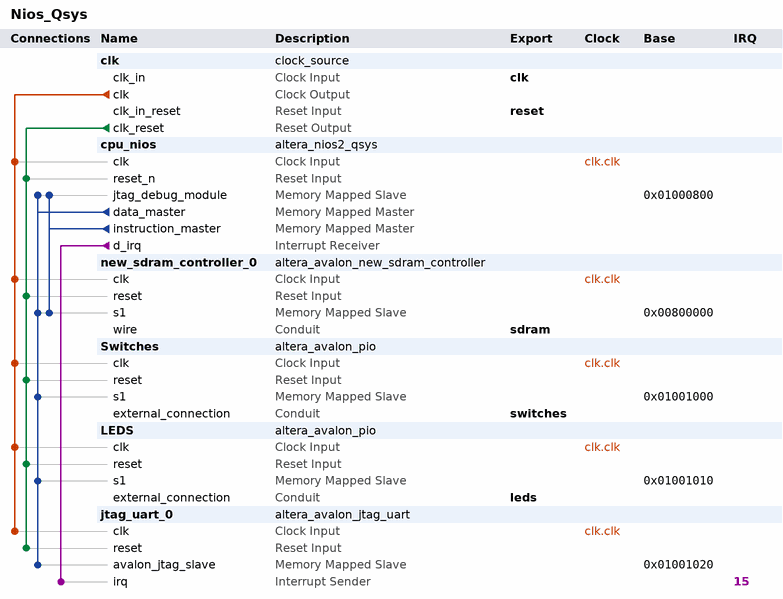
[diagram p0: system contents]
# Platform Designer (Qsys) system Nios_Qsys, Cyclone II EP2C35F672C6
# Parameters at their usual value, and those the tool derives, are not listed.
package require -exact qsys 13.0.1.99.2
create_system Nios_Qsys
set_project_property DEVICE_FAMILY {Cyclone II}
set_project_property DEVICE EP2C35F672C6

add_instance clk clock_source 13.0
set_instance_parameter_value clk clockFrequency 50000000

add_instance cpu_nios altera_nios2_qsys 13.0
set_instance_parameter_value cpu_nios resetSlave new_sdram_controller_0.s1
set_instance_parameter_value cpu_nios mmu_TLBMissExcSlave None
set_instance_parameter_value cpu_nios exceptionSlave new_sdram_controller_0.s1
set_instance_parameter_value cpu_nios breakSlave cpu_nios.jtag_debug_module
set_instance_parameter_value cpu_nios impl Tiny
set_instance_parameter_value cpu_nios icache_size 4096

add_instance new_sdram_controller_0 altera_avalon_new_sdram_controller 13.0.1.99.2
set_instance_parameter_value new_sdram_controller_0 TAC 5.5
set_instance_parameter_value new_sdram_controller_0 TRCD 20.0
set_instance_parameter_value new_sdram_controller_0 TRP 20.0
set_instance_parameter_value new_sdram_controller_0 casLatency 3
set_instance_parameter_value new_sdram_controller_0 columnWidth 8
set_instance_parameter_value new_sdram_controller_0 dataWidth 16
set_instance_parameter_value new_sdram_controller_0 generateSimulationModel false
set_instance_parameter_value new_sdram_controller_0 model single_Micron_MT48LC4M32B2_7_chip
set_instance_parameter_value new_sdram_controller_0 numberOfBanks 4
set_instance_parameter_value new_sdram_controller_0 numberOfChipSelects 1
set_instance_parameter_value new_sdram_controller_0 powerUpDelay 100.0
set_instance_parameter_value new_sdram_controller_0 refreshPeriod 15.625
set_instance_parameter_value new_sdram_controller_0 rowWidth 12

add_instance Switches altera_avalon_pio 13.0.1.99.2
set_instance_parameter_value Switches direction Input
set_instance_parameter_value Switches width 18

add_instance LEDS altera_avalon_pio 13.0.1.99.2
set_instance_parameter_value LEDS direction Output
set_instance_parameter_value LEDS width 18

add_instance jtag_uart_0 altera_avalon_jtag_uart 13.0.1.99.2
set_instance_parameter_value jtag_uart_0 simInteractiveOptions NO_INTERACTIVE_WINDOWS

# connections
add_connection clk.clk cpu_nios.clk clock
add_connection clk.clk jtag_uart_0.clk clock
add_connection clk.clk LEDS.clk clock
add_connection clk.clk new_sdram_controller_0.clk clock
add_connection clk.clk Switches.clk clock
add_connection clk.clk_reset cpu_nios.reset_n reset
add_connection clk.clk_reset jtag_uart_0.reset reset
add_connection clk.clk_reset LEDS.reset reset
add_connection clk.clk_reset new_sdram_controller_0.reset reset
add_connection clk.clk_reset Switches.reset reset
add_connection cpu_nios.data_master cpu_nios.jtag_debug_module avalon
set_connection_parameter_value cpu_nios.data_master/cpu_nios.jtag_debug_module baseAddress 0x01000800
add_connection cpu_nios.data_master jtag_uart_0.avalon_jtag_slave avalon
set_connection_parameter_value cpu_nios.data_master/jtag_uart_0.avalon_jtag_slave baseAddress 0x01001020
add_connection cpu_nios.data_master LEDS.s1 avalon
set_connection_parameter_value cpu_nios.data_master/LEDS.s1 baseAddress 0x01001010
add_connection cpu_nios.data_master new_sdram_controller_0.s1 avalon
set_connection_parameter_value cpu_nios.data_master/new_sdram_controller_0.s1 baseAddress 0x00800000
add_connection cpu_nios.data_master Switches.s1 avalon
set_connection_parameter_value cpu_nios.data_master/Switches.s1 baseAddress 0x01001000
add_connection cpu_nios.instruction_master cpu_nios.jtag_debug_module avalon
set_connection_parameter_value cpu_nios.instruction_master/cpu_nios.jtag_debug_module baseAddress 0x01000800
add_connection cpu_nios.instruction_master new_sdram_controller_0.s1 avalon
set_connection_parameter_value cpu_nios.instruction_master/new_sdram_controller_0.s1 baseAddress 0x00800000
add_connection cpu_nios.d_irq jtag_uart_0.irq interrupt
set_connection_parameter_value cpu_nios.d_irq/jtag_uart_0.irq irqNumber 15

# exported interfaces
add_interface clk clock sink
set_interface_property clk EXPORT_OF clk.clk_in
add_interface reset reset sink
set_interface_property reset EXPORT_OF clk.clk_in_reset
add_interface switches conduit end
set_interface_property switches EXPORT_OF Switches.external_connection
add_interface leds conduit end
set_interface_property leds EXPORT_OF LEDS.external_connection
add_interface sdram conduit end
set_interface_property sdram EXPORT_OF new_sdram_controller_0.wire

set_interconnect_requirement {$system} qsys_mm.clockCrossingAdapter HANDSHAKE
set_interconnect_requirement {$system} qsys_mm.maxAdditionalLatency 0

save_system Nios_Qsys.qsys
